# Altium schematic sheet MC60.SchDoc
size A2; SheetNumber: 5; SheetTotal: 8
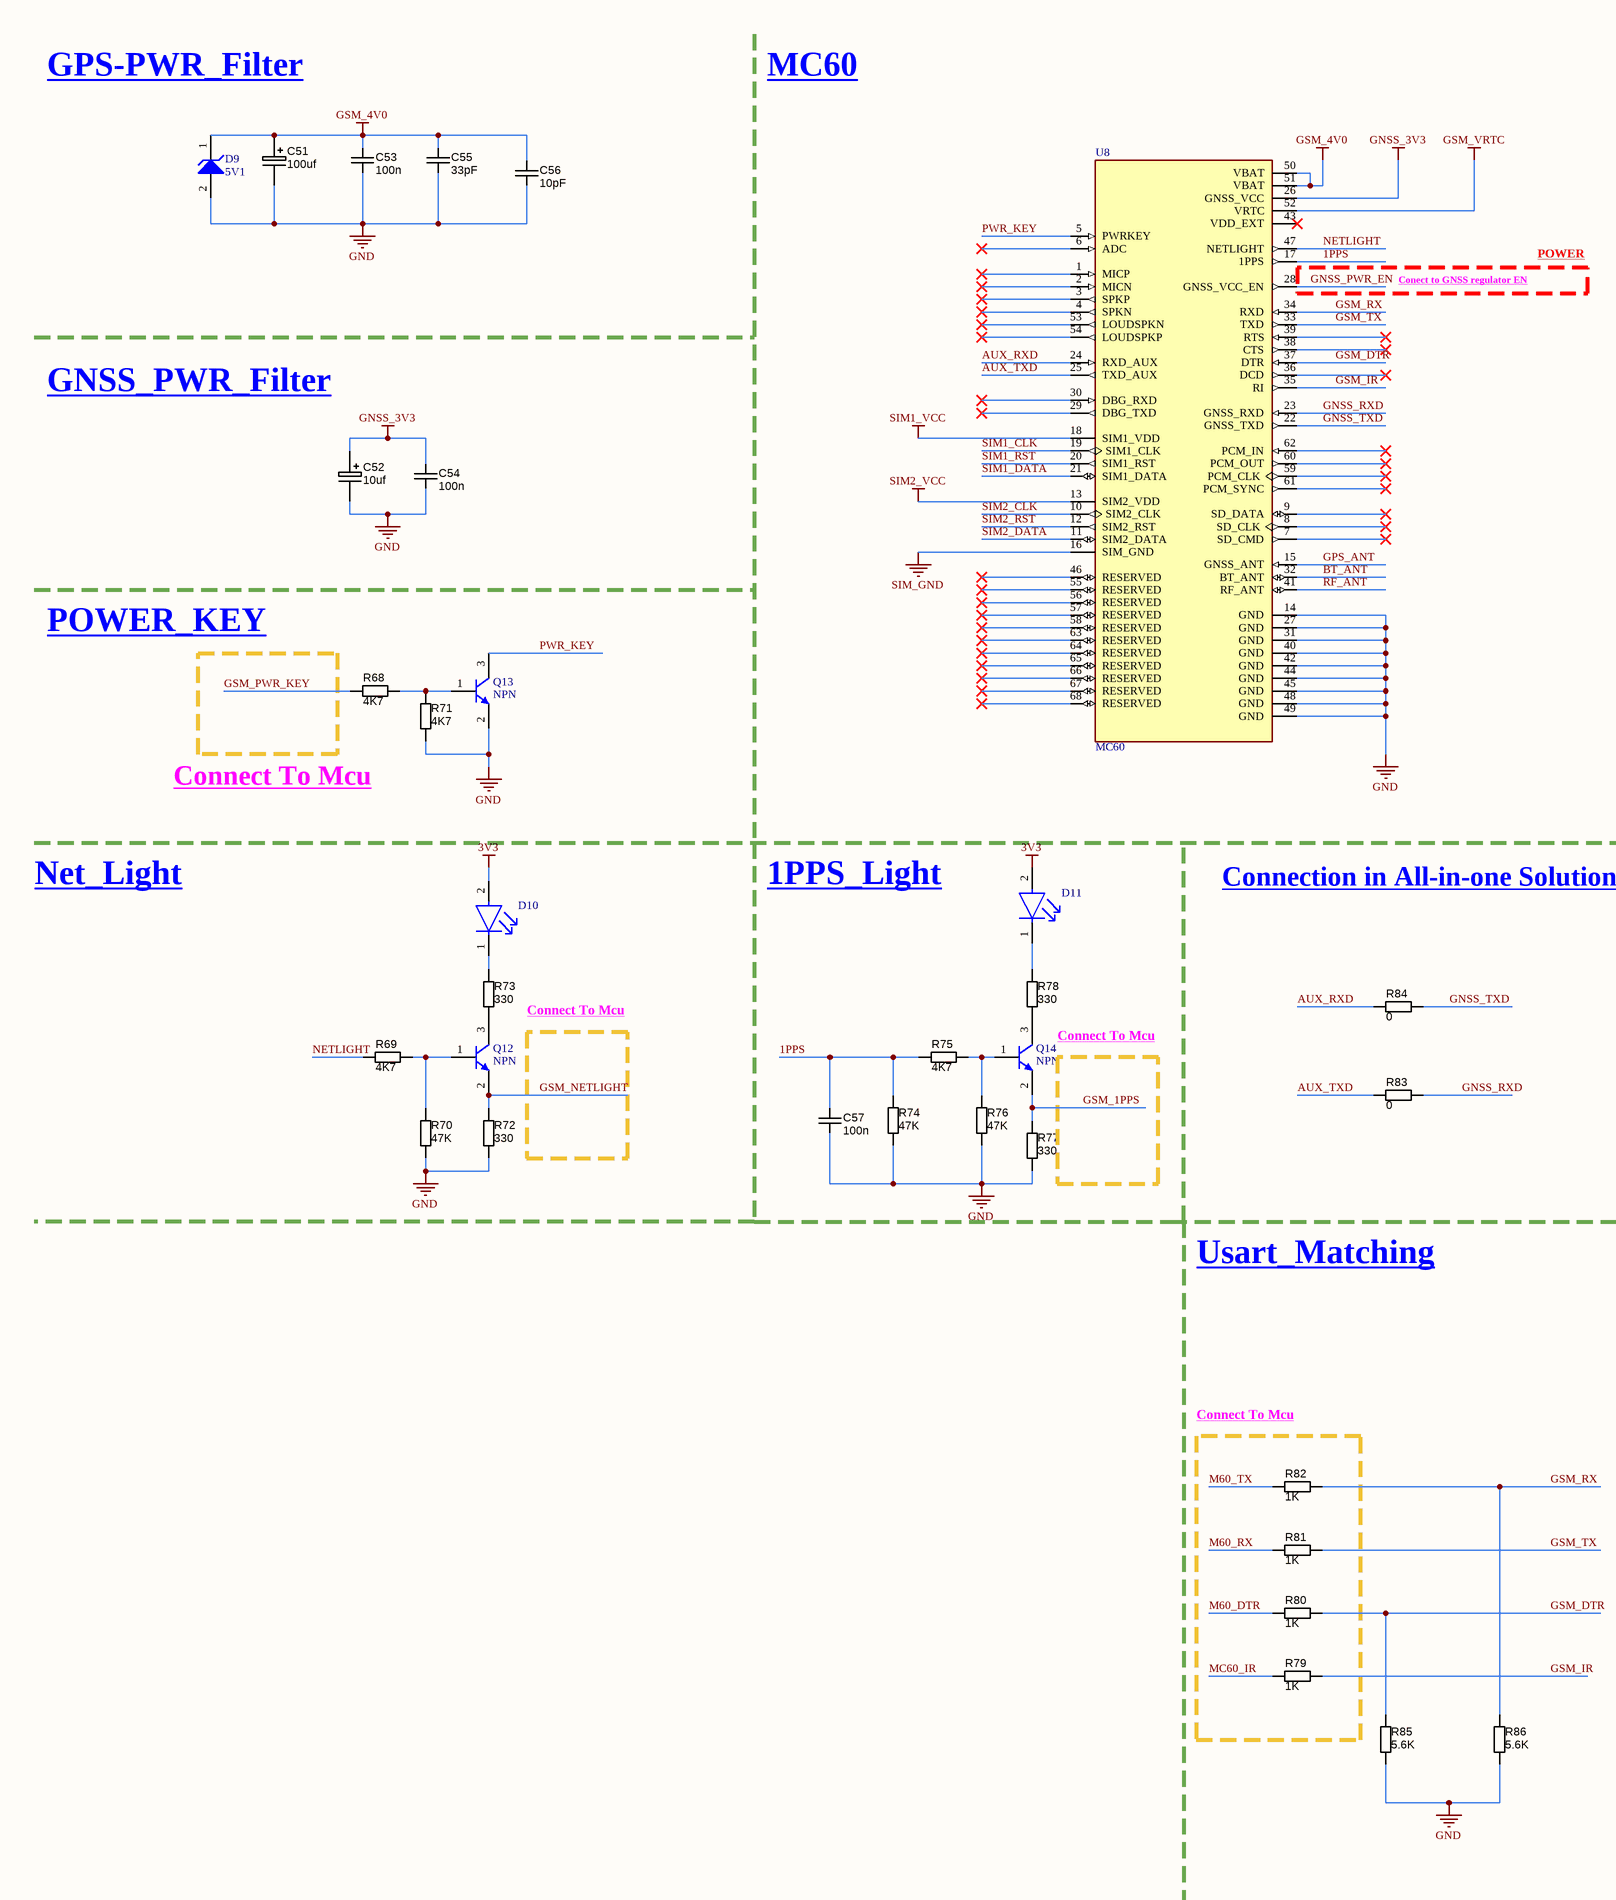
[diagram p0: MC60.SchDoc, left]
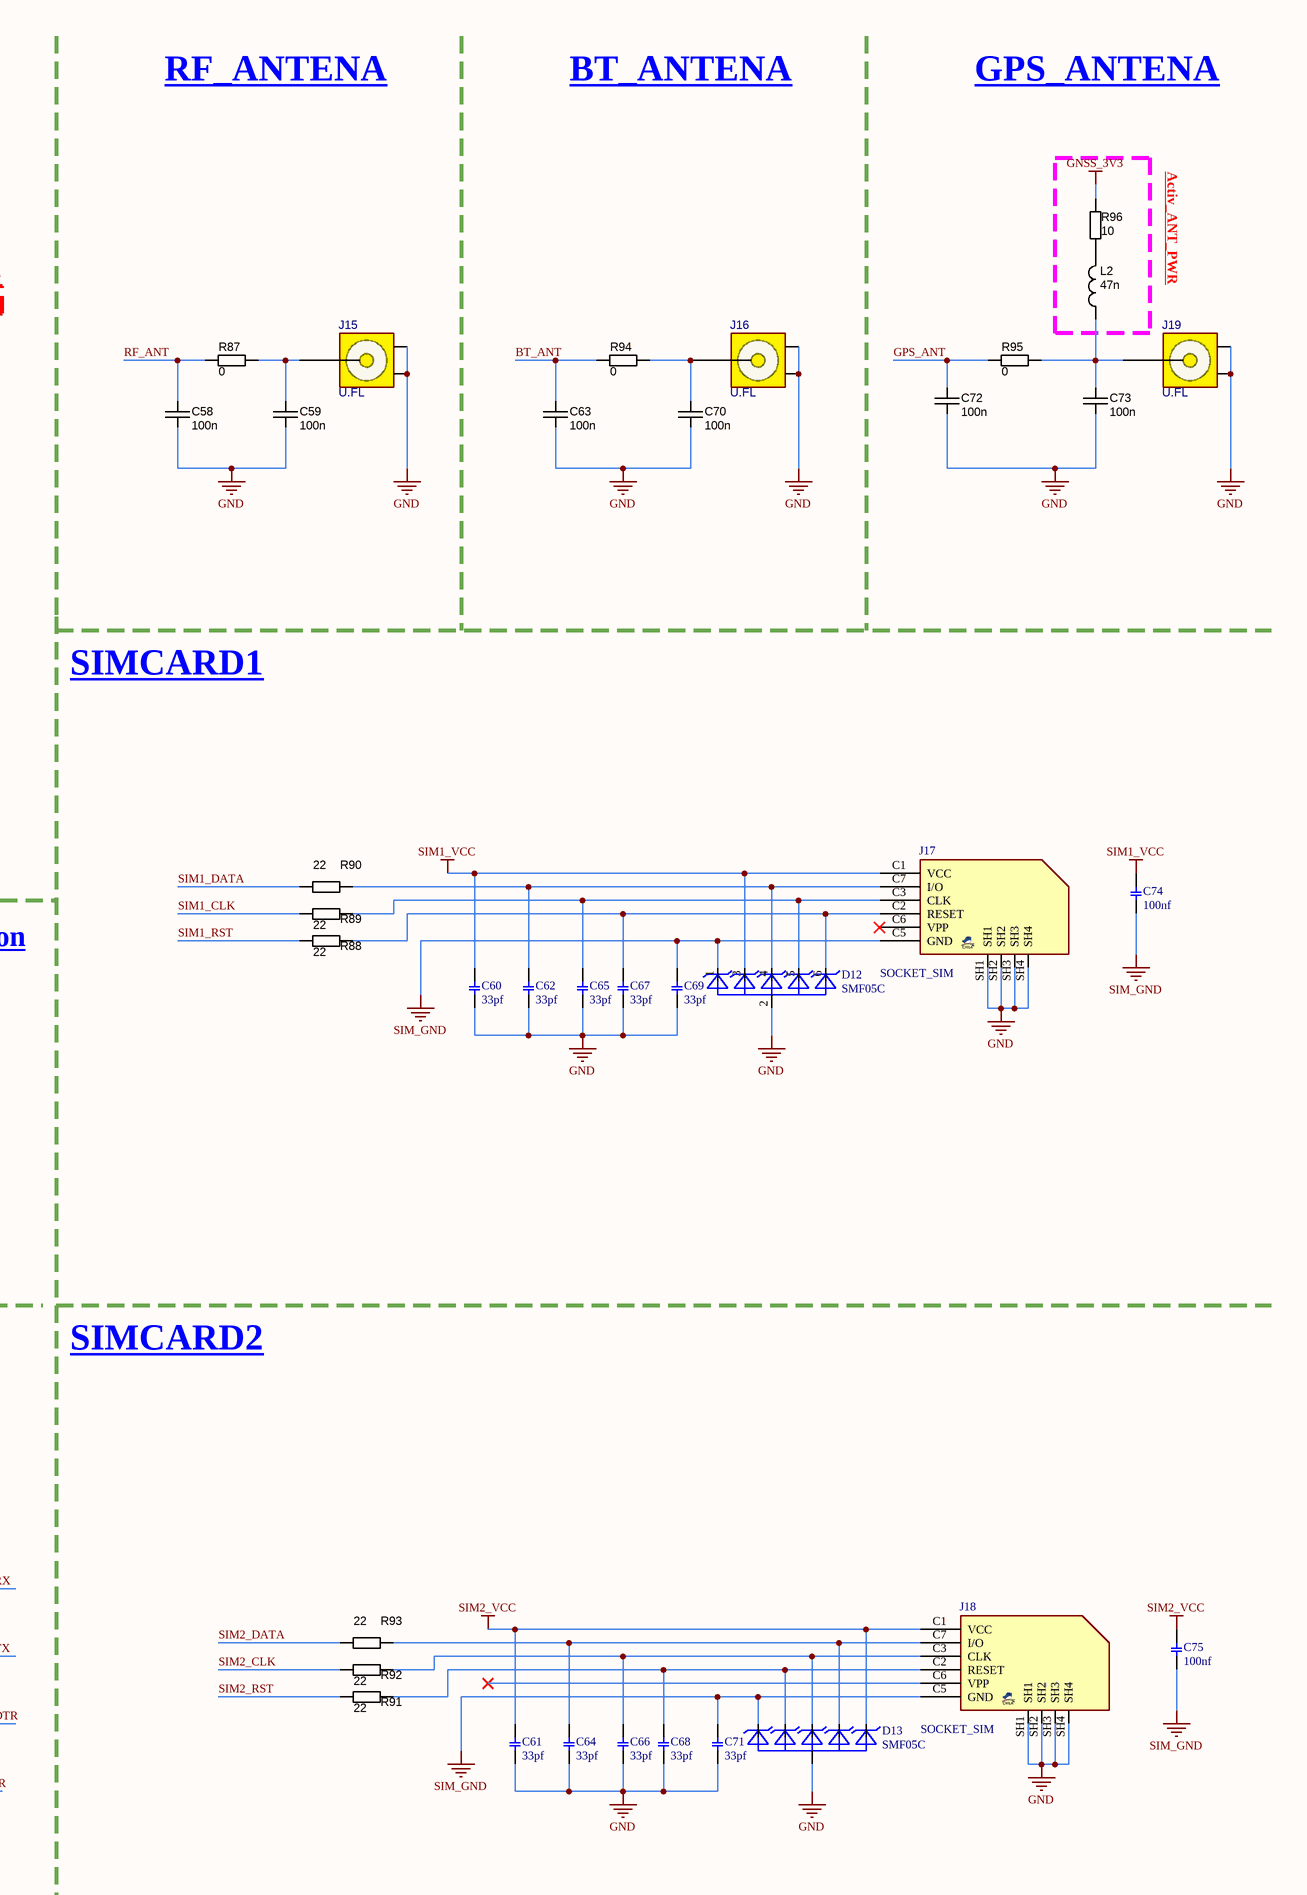
[diagram p1: MC60.SchDoc, right]

## Parts
C51  value 100uf  [C_TN_3528]
C52  value 10uf  [C_TN_3528]
C53  value 100n  [CAPC1608X90N]  (hidden comment: approved sub OK)
C54  value 100n  [CAPC1608X90N]  (hidden comment: approved sub OK)
C55  value 33pF  [CAPC1608X90N]  (hidden comment: approved sub OK)
C56  value 10pF  [CAPC1608X90N]  (hidden comment: approved sub OK)
C57  value 100n  [CAPC1608X90N]  (hidden comment: approved sub OK)
C58  value 100n  [C0402]  (hidden comment: approved sub OK)
C59  value 100n  [C0402]  (hidden comment: approved sub OK)
C60  value 33pf  [0603]  (hidden comment: Capacitor C SMD 0603)
C61  value 33pf  [0603]  (hidden comment: Capacitor C SMD 0603)
C62  value 33pf  [0603]  (hidden comment: Capacitor C SMD 0603)
C63  value 100n  [C0402]  (hidden comment: approved sub OK)
C64  value 33pf  [0603]  (hidden comment: Capacitor C SMD 0603)
C65  value 33pf  [0603]  (hidden comment: Capacitor C SMD 0603)
C66  value 33pf  [0603]  (hidden comment: Capacitor C SMD 0603)
C67  value 33pf  [0603]  (hidden comment: Capacitor C SMD 0603)
C68  value 33pf  [0603]  (hidden comment: Capacitor C SMD 0603)
C69  value 33pf  [0603]  (hidden comment: Capacitor C SMD 0603)
C70  value 100n  [C0402]  (hidden comment: approved sub OK)
C71  value 33pf  [0603]  (hidden comment: Capacitor C SMD 0603)
C72  value 100n  [C0402]  (hidden comment: approved sub OK)
C73  value 100n  [C0402]  (hidden comment: approved sub OK)
C74  value 100nf  [0603]  (hidden comment: Capacitor C SMD 0603)
C75  value 100nf  [0603]  (hidden comment: Capacitor C SMD 0603)
D9  5V1  [ONSC-SMA-2-403D-02_F_V]
D10  LTST-C191TBKT  [FP-LTST-C191TBKT-MFG]  (value not drawn)
D11  LTST-C191TBKT  [FP-LTST-C191TBKT-MFG]  (value not drawn)
D12  SMF05C  [SC70-6]
D13  SMF05C  [SC70-6]
J15  U.FL  [UFL]
J16  U.FL  [UFL]
J17  SOCKET_SIM  [SIM_MICRO_GCT]
J18  SOCKET_SIM  [SIM_MICRO_GCT]
J19  U.FL  [UFL]
L2  47n  [L0603]
Q12  NPN  [SOT23-3]
Q13  NPN  [SOT23-3]
Q14  NPN  [SOT23-3]
R68  value 4K7  [RESC1608X55N]  (hidden comment: Thick Film)
R69  value 4K7  [RESC1608X55N]  (hidden comment: Thick Film)
R70  value 47K  [RESC1608X55N]  (hidden comment: Thick Film)
R71  value 4K7  [RESC1608X55N]  (hidden comment: Thick Film)
R72  value 330  [RESC1608X55N]  (hidden comment: Thick Film)
R73  value 330  [RESC1608X55N]  (hidden comment: Thick Film)
R74  value 47K  [RESC1608X55N]  (hidden comment: Thick Film)
R75  value 4K7  [RESC1608X55N]  (hidden comment: Thick Film)
R76  value 47K  [RESC1608X55N]  (hidden comment: Thick Film)
R77  value 330  [RESC1608X55N]  (hidden comment: Thick Film)
R78  value 330  [RESC1608X55N]  (hidden comment: Thick Film)
R79  value 1K  [RESC1608X55N]  (hidden comment: Thick Film)
R80  value 1K  [RESC1608X55N]  (hidden comment: Thick Film)
R81  value 1K  [RESC1608X55N]  (hidden comment: Thick Film)
R82  value 1K  [RESC1608X55N]  (hidden comment: Thick Film)
R83  value 0  [RESC1608X55N]  (hidden comment: Thick Film)
R84  value 0  [RESC1608X55N]  (hidden comment: Thick Film)
R85  value 5.6K  [RESC1608X55N]  (hidden comment: Thick Film)
R86  value 5.6K  [RESC1608X55N]  (hidden comment: Thick Film)
R87  value 0  [0402]  (hidden comment: Thick Film)
R88  value 22  [RESC1608X55N]  (hidden comment: Thick Film)
R89  value 22  [RESC1608X55N]  (hidden comment: Thick Film)
R90  value 22  [RESC1608X55N]  (hidden comment: Thick Film)
R91  value 22  [RESC1608X55N]  (hidden comment: Thick Film)
R92  value 22  [RESC1608X55N]  (hidden comment: Thick Film)
R93  value 22  [RESC1608X55N]  (hidden comment: Thick Film)
R94  value 0  [0402]  (hidden comment: Thick Film)
R95  value 0  [0402]  (hidden comment: Thick Film)
R96  value 10  [0402]  (hidden comment: Thick Film)
U8  MC60  [XCVR_MC60]

## Blocks framed on the sheet
Connect To Mcu: R79-R82

## Nets
3V3: D10.2(A) D11.2(A)
GND: C51.2 C52.2 C53.2 C54.2 C55.2 C56.2 C57.2 C58.2 C59.2 C60.1 C61.1 C62.1 C63.2 C64.1 C65.1 C66.1 C67.1 C68.1 C69.1 C70.2 C71.1 C72.2 C73.2 D9.2(A) D12.2(A) D13.2(A) J15.2(G1) J15.3(G2) J16.2(G1) J16.3(G2) J17.SH1 J17.SH2 J17.SH3 J17.SH4 J18.SH1 J18.SH2 J18.SH3 J18.SH4 J19.2(G1) J19.3(G2) Q13.2(E) R70.2 R71.2 R72.2 R74.2 R76.2 R77.2 R85.2 R86.2 U8.14(GND) U8.27(GND) U8.31(GND) U8.40(GND) U8.42(GND) U8.44(GND) U8.45(GND) U8.48(GND) U8.49(GND)
GNSS_3V3: C52.1 C54.1 R96.1 U8.26(GNSS_VCC)
GSM_4V0: C51.1 C53.1 C55.1 C56.1 D9.1(K) U8.50(VBAT) U8.51(VBAT)
GSM_VRTC: U8.52(VRTC)
SIM1_VCC: C60.2 C74.2 D12.3(C2) J17.C1(VCC) U8.18(SIM1_VDD)
SIM2_VCC: C61.2 C75.2 D13.6(C5) J18.C1(VCC) U8.13(SIM2_VDD)
SIM_GND: C69.2 C71.2 C74.1 C75.1 D12.1(C1) D13.1(C1) J17.C5(GND) J18.C5(GND) U8.16(SIM_GND)
1PPS: C57.1 R74.1 R75.1 U8.17(1PPS)
AUX_RXD: R84.2 U8.24(RXD_AUX)
AUX_TXD: R83.2 U8.25(TXD_AUX)
BT_ANT: C63.1 R94.2 U8.32(BT_ANT)
GNSS_PWR_EN: U8.28(GNSS_VCC_EN)
GNSS_RXD: R83.1 U8.23(GNSS_RXD)
GNSS_TXD: R84.1 U8.22(GNSS_TXD)
GPS_ANT: C72.1 R95.2 U8.15(GNSS_ANT)
GSM_1PPS: Q14.2(E) R77.1
GSM_DTR: R80.1 R85.1 U8.37(DTR)
GSM_IR: R79.1 U8.35(RI)
GSM_NETLIGHT: Q12.2(E) R72.1
GSM_PWR_KEY: R68.2
GSM_RX: R82.1 R86.1 U8.34(RXD)
GSM_TX: R81.1 U8.33(TXD)
M60_DTR: R80.2
M60_RX: R81.2
M60_TX: R82.2
MC60_IR: R79.2
NETLIGHT: R69.1 U8.47(NETLIGHT)
PWR_KEY: Q13.3(C) U8.5(PWRKEY)
RF_ANT: C58.1 R87.2 U8.41(RF_ANT)
SIM1_CLK: R89.1 U8.19(SIM1_CLK)
SIM1_DATA: R90.1 U8.21(SIM1_DATA)
SIM1_RST: R88.1 U8.20(SIM1_RST)
SIM2_CLK: R92.1 U8.10(SIM2_CLK)
SIM2_DATA: R93.1 U8.11(SIM2_DATA)
SIM2_RST: R91.1 U8.12(SIM2_RST)
NetC59_1: C59.1 J15.1(SIG) R87.1
NetC62_2: C62.2 D12.4(C3) J17.C7(I/O) R90.2
NetC64_2: C64.2 D13.5(C4) J18.C7(I/O) R93.2
NetC65_2: C65.2 D12.5(C4) J17.C3(CLK) R89.2
NetC66_2: C66.2 D13.4(C3) J18.C3(CLK) R92.2
NetC67_2: C67.2 D12.6(C5) J17.C2(RESET) R88.2
NetC68_2: C68.2 D13.3(C2) J18.C2(RESET) R91.2
NetC70_1: C70.1 J16.1(SIG) R94.1
NetC73_1: C73.1 J19.1(SIG) L2.1 R95.1
NetD10_1: D10.1(C) R73.1
NetD11_1: D11.1(C) R78.1
NetL2_2: L2.2 R96.2
NetQ12_1: Q12.1(B) R69.2 R70.1
NetQ12_3: Q12.3(C) R73.2
NetQ13_1: Q13.1(B) R68.1 R71.1
NetQ14_1: Q14.1(B) R75.2 R76.1
NetQ14_3: Q14.3(C) R78.2

Not connected (* = marked no-connect by the designer): J17 C6(VPP)*; J18 C6(VPP)*; U8 1(MICP)* 2(MICN)* 3(SPKP)* 4(SPKN)* 6(ADC)* 7(SD_CMD)* 8(SD_CLK)* 9(SD_DATA)* 29(DBG_TXD)* 30(DBG_RXD)* 36(DCD)* 38(CTS)* 39(RTS)* 43(VDD_EXT)* 46(RESERVED)* 53(LOUDSPKN)* 54(LOUDSPKP)* 55(RESERVED)* 56(RESERVED)* 57(RESERVED)* 58(RESERVED)* 59(PCM_CLK)* 60(PCM_OUT)* 61(PCM_SYNC)* 62(PCM_IN)* 63(RESERVED)* 64(RESERVED)* 65(RESERVED)* 66(RESERVED)* 67(RESERVED)* 68(RESERVED)*

## Notes on the sheet
- GPS-PWR_Filter
- MC60
- RF_ANTENA
- BT_ANTENA
- GPS_ANTENA
- Activ_ANT_PWR
- Conect to GNSS regulator EN
- POWER
- GNSS_PWR_Filter
- POWER_KEY
- SIMCARD1
- Connect To Mcu
- Net_Light
- 1PPS_Light
- Connection in All-in-one Solution
- Usart_Matching
- SIMCARD2

## Library data of the parts
C51 = CAPT_4u7_3216_16V: Capacitor SMD Tantalum 100uF 10% 16V 3216-18; Manufacturer 1: Vishay/Sprague; Manufacturer Part Number 1: 293D475X9016A2TE3; SCDType: undef; Package / Case: EIA 535BAAC size A; Ratings: 16V; Tolerance: ±10%; Material: Tantalum; Supplier 1: Digi-Key; Supplier Part Number 1: 718-1148-1-ND
C52 = CAPT_4u7_3216_16V: Capacitor SMD Tantalum 10uF 10% 16V 3216-18; Manufacturer 1: Vishay/Sprague; Manufacturer Part Number 1: 293D475X9016A2TE3; SCDType: undef; Package / Case: EIA 535BAAC size A; Ratings: 16V; Tolerance: ±10%; Material: Tantalum; Supplier 1: Digi-Key; Supplier Part Number 1: 718-1148-1-ND
C53 C54 C57-C59 C63 C70 C72 C73 = CAPC_100n_0603_X7R_50V_10%: Capacitor SMD Cer 100nF 10% 50V X7R 0603; Manufacturer 1: AVX Corporation; Manufacturer Part Number 1: 06035C104KAT2A; Ratings: 50V; X7R; Material: ceramic; SCDType: spec; Manufacturer 2: TDK Corporation; Manufacturer Part Number 2: C1608X7R1H104K; Package / Case: 0603 (1608 Metric); Tolerance: ±10%; Supplier 1: Digi-Key; Supplier Part Number 1: 478-5052-1-ND; ComponentLink1URL: http://www.avx.com/docs/Catalogs/cx7r.pdf; ComponentLink1Description: http://www.avx.com/docs/Catalogs/cx7r.pdf; Supplier 2: Digi-Key; Supplier Part Number 2: 445-1314-1-ND; ComponentLink2URL: http://product.tdk.com/capacitor/mlcc/en/documents/mlcc_commercial_general_en.pdf; ComponentLink2Description: http://product.tdk.com/capacitor/mlcc/en/documents/mlcc_commercial_general_en.pdf
C55 = CAPC_100n_0603_X7R_50V_10%: Capacitor SMD Cer 33pF10% 50V X7R 0603; Manufacturer 1: AVX Corporation; Manufacturer Part Number 1: 06035C104KAT2A; Tolerance: ±10%; Ratings: 50V; X7R; Material: ceramic; SCDType: spec; Manufacturer 2: TDK Corporation; Manufacturer Part Number 2: C1608X7R1H104K; Package / Case: 0603 (1608 Metric); Supplier 1: Digi-Key; Supplier Part Number 1: 478-5052-1-ND; ComponentLink1URL: http://www.avx.com/docs/Catalogs/cx7r.pdf; ComponentLink1Description: http://www.avx.com/docs/Catalogs/cx7r.pdf; Supplier 2: Digi-Key; Supplier Part Number 2: 445-1314-1-ND; ComponentLink2URL: http://product.tdk.com/capacitor/mlcc/en/documents/mlcc_commercial_general_en.pdf; ComponentLink2Description: http://product.tdk.com/capacitor/mlcc/en/documents/mlcc_commercial_general_en.pdf
C56 = CAPC_100n_0603_X7R_50V_10%: Capacitor SMD Cer 10pF10% 50V X7R 0603; Manufacturer 1: AVX Corporation; Manufacturer Part Number 1: 06035C104KAT2A; Tolerance: ±10%; Ratings: 50V; X7R; Material: ceramic; SCDType: spec; Manufacturer 2: TDK Corporation; Manufacturer Part Number 2: C1608X7R1H104K; Package / Case: 0603 (1608 Metric); Supplier 1: Digi-Key; Supplier Part Number 1: 478-5052-1-ND; ComponentLink1URL: http://www.avx.com/docs/Catalogs/cx7r.pdf; ComponentLink1Description: http://www.avx.com/docs/Catalogs/cx7r.pdf; Supplier 2: Digi-Key; Supplier Part Number 2: 445-1314-1-ND; ComponentLink2URL: http://product.tdk.com/capacitor/mlcc/en/documents/mlcc_commercial_general_en.pdf; ComponentLink2Description: http://product.tdk.com/capacitor/mlcc/en/documents/mlcc_commercial_general_en.pdf
D9 = CMP-1060-00099-1: 1.5 W Zener Voltage Regulator, 2-Pin SMA, Pb-Free, Tape and Reel; Manufacturer: On Semiconductor; PartNumber: 1SMA5939BT3G; VZ Typ (V): 39; Packing: Tape and Reel; ComponentLink2URL: http://www.onsemi.com/pub_link/Collateral/1SMA5913BT3-D.PDF; ComponentLink3URL: http://www.onsemi.com/pub_link/Collateral/1SMA5913BT3-D.PDF; ComponentLink3Description: Package Specification; RoHS: Pb-Free; ComponentLink2Description: Datasheet; PackageReference: SMA-2-403D-02_F; ComponentLink1URL: http://www.onsemi.com/; PackageVersion: Rev. F, 11/2008; ComponentLink1Description: Manufacturer URL; Mounting Technology: Surface Mount; DatasheetVersion: Rev. 8; PackageDescription: 2-Pin Small Molded Package, J-Bend Lead, Body 2.605 x 4.315 mm
D10 D11 = CMP-22017-000008-1: LED BLUE CLEAR CHIP SMD; Lens Color: Colorless; Dominant Wavelength: 475nm; Forward Current: 20mA; Wavelength: 468nm; Viewing Angle: 130°; Power Dissipation: 76mW; Luminous Intensity: 180mcd; Reverse Voltage: 5V; Number of Elements: 1; Lens Style: Diffused; Forward Voltage: 3.8V; Max Power Dissipation: 75mW; Case Code (Metric): 1608; Packaging: Tape and Reel; Case/Package: 0603; Depth: 1.6mm; Mount: Surface Mount; Lead Free: Lead Free; Min Operating Temperature: -20°C; Lens Transparency: Clear; Illumination Color: Blue; Height: 0.55mm; Test Current: 20mA; Case Code (Imperial): 0603; Max Operating Temperature: 80°C; Number of Pins: 2; Length: 0.8mm; Radiation Hardening: No; Package Quantity: 1; Number of LEDs: 1; Width: 0.8mm; Color: Blue
D12 D13 = SMF05C: 12.5V Clamp 8A _8/20Âµs_ Ipp Tvs Diode Surface Mount SC-88/SC70-6/SOT-363; MF: ON Semiconductor; Availability: Unavailable; Price: None; Package: SOT-363 ON Semiconductor; Value: *; SnapEDA_Link: https://www.snapeda.com/parts/SMF05C/ON%20Semiconductor/view-part/2782704/?ref=snap; MP: SMF05C
J15 J16 J19 = CONN_RF_UFL: CONN, RF, U.FL, STRAIGHT, Ultra Miniature Coaxial; MANF_P#: CONUFL001-SMD, U.FL-R-SMT-1(10), 128-0711-201; MANF: Linx, Hirose, Cinch; PARAM: 50Ohm, 6GHz; DESC: DESCRIPTION; DIST#: DIGIKEY, MOUSER; PARAM2: GOLD; ASSEMBLY: ASSEMBLY; PRICE: 0.9$; VALUE: U.FL
J17 J18 = SIM_MICRO_6: SOCKET, SIM MICRO; MANF: -; PRICE: 3t@Lion Iran; MANF_P#: -; DESC: -; VALUE: SOCKET_SIM
L2 = INDC_10u_LowRDC: Inductor SMD Low DCR 47 nH 900mA 20% 1210; Manufacturer 1: Taiyo Yuden; Manufacturer Part Number 1: CBC3225T100MR; Ratings: 900 mA; 133 mOhm; DC Resistance (DCR): 172.9 mOhm Max; Frequency - Self Resonant: 23MHz; Frequency - Test: 100kHz; SCDType: spec; Tolerance: ±20%; Supplier 1: Digi-Key; Supplier Part Number 1: 587-1625-1-ND; Current: 900mA; Current - Saturation: 900mA; Current - Temperature Rise: 900mA; Applications: Power Supplies; Package / Case: 1210 (3225 Metric); Operating Temperature: -40°C ~ 105°C; ComponentLink1URL: http://www.yuden.co.jp/ut/product/pdf/wound02_e.pdf; ComponentLink1Description: http://www.yuden.co.jp/ut/product/pdf/wound02_e.pdf; Value: 47n
Q12-Q14 = NPN: NPN Bipolar Transistor; Published: 8-Jun-2000; LatestRevisionDate: 17-Jul-2002; LatestRevisionNote: Re-released for DXP Platform.; PackageReference: TO-226-AA; Publisher: Altium Limited; PackageDescription: TO, Flat Index; 3 In-Line, Axial Leads; Body Dia. 4.8mm; Leads 0.55 x 0.51 mm (max); Code_JEDEC: TO-226-AA
R68 R69 R71 R75 = RES_4K7_0603_5%: Resistor SMD chip 4.7k Ohm 0.1W 5% 0603; Manufacturer 1: Vishay/Dale; Manufacturer Part Number 1: CRCW06034K70JNEA; Ratings: 1/10 W; SCDType: spec; Package / Case: 0603 (1608 metric); Tolerance: ±5%; Material: Thick Film; Supplier 1: Digi-Key; Supplier Part Number 1: 541-4.7KGCT-ND
R70 R74 R76 = RES_4K7_0603_5%: Resistor SMD chip 47K Ohm 0.1W 5% 0603; Manufacturer 1: Vishay/Dale; Manufacturer Part Number 1: CRCW06034K70JNEA; Ratings: 1/10 W; SCDType: spec; Package / Case: 0603 (1608 metric); Tolerance: ±5%; Material: Thick Film; Supplier 1: Digi-Key; Supplier Part Number 1: 541-4.7KGCT-ND
R72 R73 R77 R78 = RES_4K7_0603_5%: Resistor SMD chip 330 Ohm 0.1W 5% 0603; Manufacturer 1: Vishay/Dale; Manufacturer Part Number 1: CRCW06034K70JNEA; Ratings: 1/10 W; SCDType: spec; Package / Case: 0603 (1608 metric); Tolerance: ±5%; Material: Thick Film; Supplier 1: Digi-Key; Supplier Part Number 1: 541-4.7KGCT-ND
R79-R82 = RES_4K7_0603_5%: Resistor SMD chip 1K Ohm 0.1W 5% 0603; Manufacturer 1: Vishay/Dale; Manufacturer Part Number 1: CRCW06034K70JNEA; Ratings: 1/10 W; SCDType: spec; Package / Case: 0603 (1608 metric); Tolerance: ±5%; Material: Thick Film; Supplier 1: Digi-Key; Supplier Part Number 1: 541-4.7KGCT-ND
R83 R84 R87 R94 R95 = RES_4K7_0603_5%: Resistor SMD chip 0 Ohm 0.1W 5% 0603; Manufacturer 1: Vishay/Dale; Manufacturer Part Number 1: CRCW06034K70JNEA; Ratings: 1/10 W; SCDType: spec; Package / Case: 0603 (1608 metric); Tolerance: ±5%; Material: Thick Film; Supplier 1: Digi-Key; Supplier Part Number 1: 541-4.7KGCT-ND
R85 R86 = RES_4K7_0603_5%: Resistor SMD chip 5.6K Ohm 0.1W 5% 0603; Manufacturer 1: Vishay/Dale; Manufacturer Part Number 1: CRCW06034K70JNEA; Ratings: 1/10 W; SCDType: spec; Package / Case: 0603 (1608 metric); Tolerance: ±5%; Material: Thick Film; Supplier 1: Digi-Key; Supplier Part Number 1: 541-4.7KGCT-ND
R88-R93 = RES_4K7_0603_5%: Resistor SMD chip 22 Ohm 0.1W 5% 0603; Manufacturer 1: Vishay/Dale; Manufacturer Part Number 1: CRCW06034K70JNEA; Ratings: 1/10 W; SCDType: spec; Package / Case: 0603 (1608 metric); Tolerance: ±5%; Material: Thick Film; Supplier 1: Digi-Key; Supplier Part Number 1: 541-4.7KGCT-ND
R96 = RES_4K7_0603_5%: Resistor SMD chip 10 Ohm 0.1W 5% 0603; Manufacturer 1: Vishay/Dale; Manufacturer Part Number 1: CRCW06034K70JNEA; Ratings: 1/10 W; SCDType: spec; Package / Case: 0603 (1608 metric); Tolerance: ±5%; Material: Thick Film; Supplier 1: Digi-Key; Supplier Part Number 1: 541-4.7KGCT-ND
U8 = MC60: MC60 is a quad-band full-featured 2G GSM/GPRS module using LCC castellation package. With an extensive set of Internet protocols _TCP, UDP, PPP, FTP, HTTP and SSL_, it has integrated the GNSS technology for satellite navigation; MF: Quectel; Value: *; Price: None; Package: DIP-8 Quectel; SnapEDA_Link: https://www.snapeda.com/parts/MC60/Quectel/view-part/4388480/?ref=snap; Availability: Unavailable; MP: MC60
C60-C62 C64-C69 C71 C74 C75 = Capacitor C SMD 0603: DatasheetVersion: 2021; ComponentLink1Description: Website Smart World; ComponentLink1URL: https://www.smartw.ir/; ComponentLink2Description: Telegram; ComponentLink2URL: https://t.me/altium_smartw; ComponentLink3Description: Instagram; ComponentLink3URL: https://Instagram.com/smartgw.ir